# Altium project sensor_board.PrjPcb
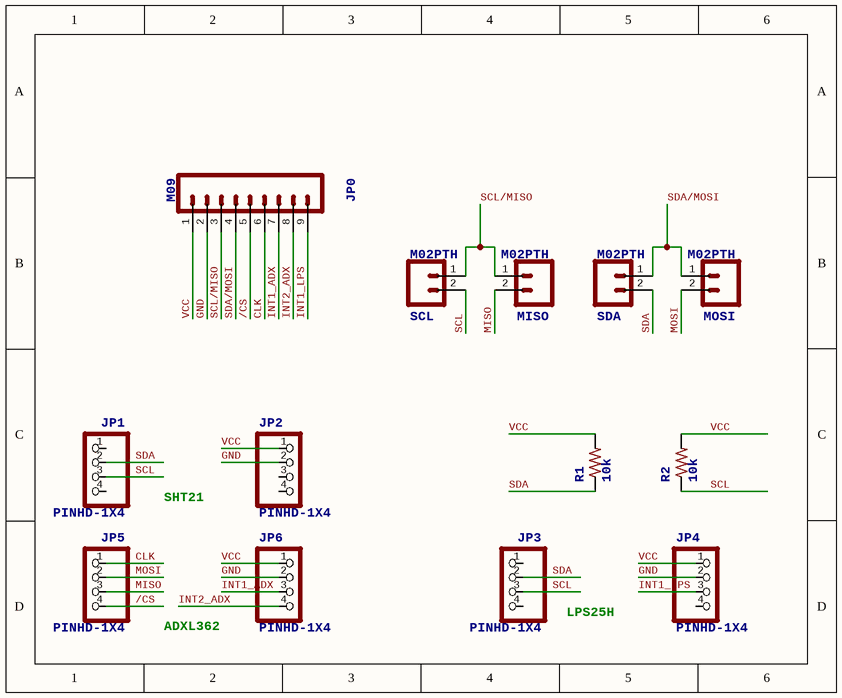
[diagram p0: sensor_board.SchDoc]
1 sheet, 13 parts. Net scope: global (net labels, ports and power ports of the same name join across sheets).

## Sheet sensor_board.SchDoc
size 146 x 121 mm

### Parts
JP0  M09  [1X09]
JP1  PINHD-1X4  [1X04]
JP2  PINHD-1X4  [1X04]
JP3  PINHD-1X4  [1X04]
JP4  PINHD-1X4  [1X04]
JP5  PINHD-1X4  [1X04]
JP6  PINHD-1X4  [1X04]
MISO  M02PTH  [1X02]
MOSI  M02PTH  [1X02]
R1  10k  [AXIAL-0.3]
R2  10k  [AXIAL-0.3]
SCL  M02PTH  [1X02]
SDA  M02PTH  [1X02]

### Nets
/CS: JP0.5 JP5.4
CLK: JP0.6 JP5.1
GND: JP0.2 JP2.2 JP4.2 JP6.2
INT1_ADX: JP0.7 JP6.3
INT1_LPS: JP0.9 JP4.3
INT2_ADX: JP0.8 JP6.4
MISO: JP5.3 MISO.2
MOSI: JP5.2 MOSI.2
SCL: JP1.3 JP3.3 R2.P$1 SCL.2
SCL/MISO: JP0.3 MISO.1 SCL.1
SDA: JP1.2 JP3.2 R1.P$1 SDA.2
SDA/MOSI: JP0.4 MOSI.1 SDA.1
VCC: JP0.1 JP2.1 JP4.1 JP6.1 R1.P$2 R2.P$2

Not connected (* = marked no-connect by the designer): JP1 1 4; JP2 3 4; JP3 1 4; JP4 4

### Notes on the sheet
- SHT21
- ADXL362
- LPS25H

### Library data of the parts
JP0 = M09: <b>Header 9</b> / Standard 9-pin 0.1" header. Use with straight break away headers (SKU : PRT-00116), right angle break away headers (PRT-00553), swiss pins (PRT-00743), machine pins (PRT-00117), and female headers (PRT-00115).
JP1-JP6 = PINHD-1X4: <b>PIN HEADER</b>
MISO MOSI SCL SDA = M02PTH: Standard 2-pin 0.1" header. Use with <br> / - straight break away headers ( PRT-00116)<br> / - right angle break away headers (PRT-00553)<br> / - swiss pins (PRT-00743)<br> / - machine pins (PRT-00117)<br> / - female headers (PRT-00115)<br><br> / Molex polarized connector foot print use with: PRT-08233 with associated crimp pins and housings.<br><br> / 2.54_SCREWTERM for use with  PRT-10571.<br><br> / 3.5mm Screw Terminal footprints for  PRT-08084<br><br> / 5mm Screw Terminal footprints for use with PRT-08432
R1 R2 = 10KOHM-1/4W5%(PTH): RES-09435; PROD_ID: RES-9435; VALUE: 10k